# EAGLE design RFM96W-BB (EAGLE 7.3.0)
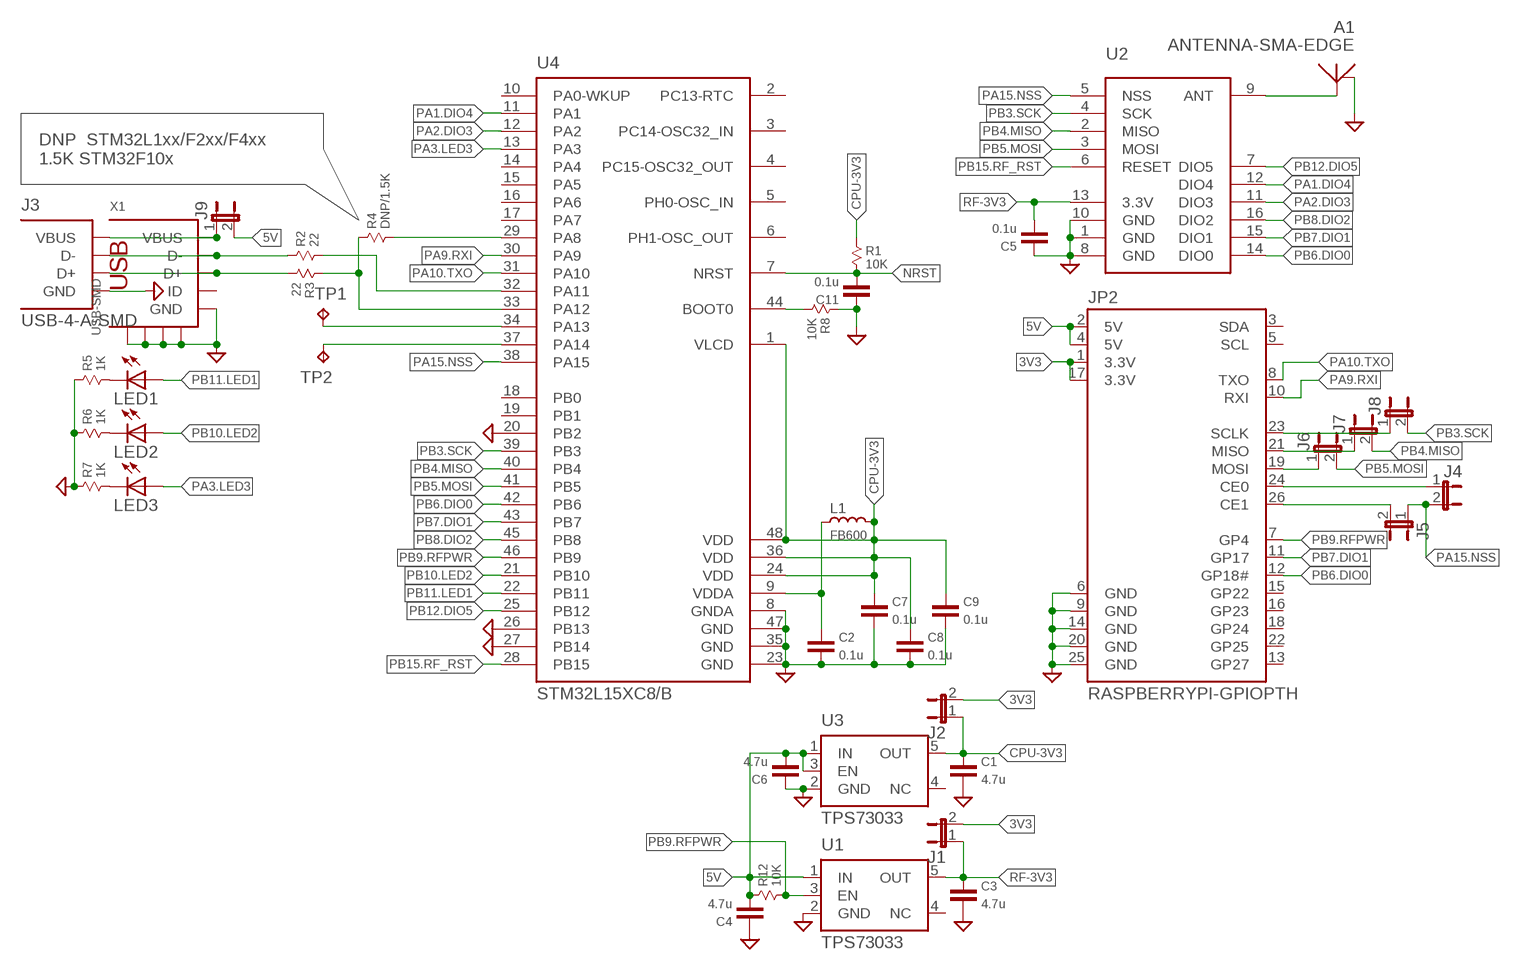
[diagram p0: schematic, sheet 1]

## Parts
A1  ANTENNA-SMA-EDGE  [SMA-EDGE]
C1  4.7u  CAP-0603  [0603]
C2  0.1u  CAP-0603  [0603]
C3  4.7u  CAP-0603  [0603]
C4  4.7u  CAP-0603  [0603]
C5  0.1u  CAP-0603  [0603]
C6  4.7u  CAP-0603  [0603]
C7  0.1u  CAP-0603  [0603]
C8  0.1u  CAP-0603  [0603]
C9  0.1u  CAP-0603  [0603]
C11  0.1u  CAP-0603  [0603]
J1  JUMPER-2SMD-NO  [SJ_2S-NO]
J2  JUMPER-2SMD-NO  [SJ_2S-NO]
J3  USB-4-A-SMD  [USB-A-SMD]
J4  JUMPER-2SMD-NO  [SJ_2S-NO]
J5  JUMPER-2SMD-NO  [SJ_2S-NO]
J6  JUMPER-2SMD-NO  [SJ_2S-NO]
J7  JUMPER-2SMD-NO  [SJ_2S-NO]
J8  JUMPER-2SMD-NO  [SJ_2S-NO]
J9  JUMPER-2SMD-NO  [SJ_2S-NO]
JP2  RASPBERRYPI-GPIOPTH  [2X13-SHROUDED]
L1  FB600  INDUCTOR-0603  [0603]
LED1  LEDCHIPLED_0603  [CHIPLED_0603]
LED2  LEDCHIPLED_0603  [CHIPLED_0603]
LED3  LEDCHIPLED_0603  [CHIPLED_0603]
R1  10K  RESISTOR-0603  [0603]
R2  22  RESISTOR-0603  [0603]
R3  22  RESISTOR-0603  [0603]
R4  DNP/1.5K  RESISTOR-0603  [0603]
R5  1K  RESISTOR-0603  [0603]
R6  1K  RESISTOR-0603  [0603]
R7  1K  RESISTOR-0603  [0603]
R8  10K  RESISTOR-0603  [0603]
R12  10K  RESISTOR-0603  [0603]
TP1  TPTP14R  [TP14R]
TP2  TPTP14R  [TP14R]
U1  TPS73033  [SOT23-5]
U2  RFM9XW  [RFM9XW]
U3  TPS73033  [SOT23-5]
U4  STM32L15XC8/B  [LQFP48]
X1  USB-SMD  [USB-MINIB]

## Nets
3V3: J1.2 J2.2 JP2.1(3.3V) JP2.17(3.3V)
5V: C4.1 C6.1 J9.2 JP2.2(5V) JP2.4(5V) R12.1 U1.1(IN) U3.1(IN) U3.3(EN)
CPU-3V3: C1.2 C7.2 C8.2 C9.2 J2.1 L1.2 R1.1 U3.5(OUT) U4.1(VLCD) U4.24(VDD) U4.36(VDD) U4.48(VDD)
GND: A1.GND@1(GND) C1.1 C2.1 C3.1 C4.2 C5.2 C6.2 C7.1 C8.1 C9.1 C11.2 J3.GND JP2.6(GND) JP2.9(GND) JP2.14(GND) JP2.20(GND) JP2.25(GND) R5.1 R6.1 R7.1 R8.1 U1.2(GND) U2.1(GND) U2.8(GND) U2.10(GND) U3.2(GND) U4.8(GNDA) U4.20(PB2) U4.23(GND) U4.26(PB13) U4.27(PB14) U4.35(GND) U4.47(GND) X1.GND X1.GND@1(GND) X1.GND@2(GND) X1.GND@3(GND) X1.GND@4(GND)
N$1: C2.2 L1.1 U4.9(VDDA)
N$3: A1.ANT U2.9(ANT)
N$4: J3.VUSB(VBUS) J9.1 X1.VBUS
N$7: J3.D- R2.1 X1.D-
N$8: J3.D+ R3.2 X1.D+
N$11: J8.1 JP2.23(SCLK)
N$12: J7.1 JP2.21(MISO)
N$14: J4.1 JP2.24(CE0)
N$15: J5.2 JP2.26(CE1)
N$16: R8.2 U4.44(BOOT0)
N$18: LED1.C R5.2
N$19: LED2.C R6.2
N$20: LED3.C R7.2
NRST: C11.1 R1.2 U4.7(NRST)
PA1.DIO4: U2.12(DIO4) U4.11(PA1)
PA2.DIO3: U2.11(DIO3) U4.12(PA2)
PA3.LED3: LED3.A U4.13(PA3)
PA8.D+H: R4.2 U4.29(PA8)
PA9.RXI: JP2.10(RXI) U4.30(PA9)
PA10.TXO: JP2.8(TXO) U4.31(PA10)
PA11.D-: R2.2 U4.32(PA11)
PA12.D+: R3.1 R4.1 U4.33(PA12)
PA13: TP1.TP U4.34(PA13)
PA14: TP2.TP U4.37(PA14)
PA15.NSS: J4.2 J5.1 U2.5(NSS) U4.38(PA15)
PB3.SCK: J8.2 U2.4(SCK) U4.39(PB3)
PB4.MISO: J7.2 U2.2(MISO) U4.40(PB4)
PB5.MOSI: J6.2 U2.3(MOSI) U4.41(PB5)
PB6.DIO0: JP2.12(GP18#) U2.14(DIO0) U4.42(PB6)
PB7.DIO1: JP2.11(GP17) U2.15(DIO1) U4.43(PB7)
PB8.DIO2: U2.16(DIO2) U4.45(PB8)
PB9.RFPWR: JP2.7(GP4) R12.2 U1.3(EN) U4.46(PB9)
PB10.LED2: LED2.A U4.21(PB10)
PB11.LED1: LED1.A U4.22(PB11)
PB12.DIO5: U2.7(DIO5) U4.25(PB12)
PB15.RF_RST: U2.6(RESET) U4.28(PB15)
R-MOSI: J6.1 JP2.19(MOSI)
RF-3V3: C3.2 C5.1 J1.1 U1.5(OUT) U2.13(3.3V)
Unconnected: JP2.3(SDA) JP2.5(SCL) JP2.13(GP27) JP2.15(GP22) JP2.16(GP23) JP2.18(GP24) JP2.22(GP25) U1.4(NC) U3.4(NC) U4.2(PC13-RTC) U4.3(PC14-OSC32_IN) U4.4(PC15-OSC32_OUT) U4.5(PH0-OSC_IN) U4.6(PH1-OSC_OUT) U4.10(PA0-WKUP) U4.14(PA4) U4.15(PA5) U4.16(PA6) U4.17(PA7) U4.18(PB0) U4.19(PB1) X1.ID

## Notes on the sheet
- DNP  STM32L1xx/F2xx/F4xx
  1.5K STM32F10x

## Library data of the parts
A1 = X893:ANTENNA: Antennes
C1-C9 C11 = X893:CAP: Capacitor
J1 J2 J4-J9 = X893:JUMPER-2: Jumper Basic 0.1" spaced jumper. Use with breakaway headers.
J3 = X893:USB-4: http://www.hirose.co.jp/cataloge_hp/e24200011.pdf
JP2 = SparkFun-Boards:RASPBERRYPI-GPIO: RASPBERRY PI I/O HEADER As defined for the Revistion 2 Pi.; DIST: sparkfun; DIST_ID: PRT-11490
L1 = X893:INDUCTOR: http://www.murata.com/products/catalog/pdf/o05e.pdf
LED1-LED3 = led:LED: LED OSRAM: - CHIPLED LG R971, LG N971, LY N971, LG Q971, LY Q971, LO R971, LY R971 LH N974, LH R974 LS Q976, LO Q976, LY Q976 LO Q996 - Hyper CHIPLED LW Q18S LB Q993, LB Q99A, LB R99A - SideLED LS A670, LO A670, LY A670, LG A670, LP A670 LB A673, LV A673, LT A673, LW A673 LH A674 LY A675 LS A676, LA A676, LO A676, LY A676, LW A676 LS A679, LY A679, LG A679 - Hyper Micro SIDELED® LS Y876, LA Y876, LO Y876, LY Y876 LT Y87S - SmartLED LW L88C, LW L88S LB L89C, LB L89S, LG L890 LS L89K, LO L89K, LY L89K LS L896, LA L896, LO L896, LY L896 - TOPLED LS T670, LO T670, LY T670, LG T670, LP T670 LSG T670, LSP T670, LSY T670, LOP T670, LYG T670 LG T671, LOG T671, LSG T671 LB T673, LV T673, LT T673, LW T673 LH T674 LS T676, LA T676, LO T676, LY T676, LB T676, LH T676, LSB T676, LW T676 LB T67C, LV T67C, LT T67C, LS T67K, LO T67K, LY T67K, LW E67C LS E67B, LA E67B, LO E67B, LY E67B, LB E67C, LV E67C, LT E67C LW T67C LS T679, LY T679, LG T679 LS T770, LO T770, LY T770, LG T770, LP T770 LB T773, LV T773, LT T773, LW T773 LH T774 LS E675, LA E675, LY E675, LS T675 LS T776, LA T776, LO T776, LY T776, LB T776 LHGB T686 LT T68C, LB T68C - Hyper Mini TOPLED® LB M676 - Mini TOPLED Santana® LG M470 LS M47K, LO M47K, LY M47K Source: http://www.osram.convergy.de LUXEON: - LUMILED® LXK2-PW12-R00, LXK2-PW12-S00, LXK2-PW14-U00, LXK2-PW14-V00 LXK2-PM12-R00, LXK2-PM12-S00, LXK2-PM14-U00 LXK2-PE12-Q00, LXK2-PE12-R00, LXK2-PE12-S00, LXK2-PE14-T00, LXK2-PE14-U00 LXK2-PB12-K00, LXK2-PB12-L00, LXK2-PB12-M00, LXK2-PB14-N00, LXK2-PB14-P00, LXK2-PB14-Q00 LXK2-PR12-L00, LXK2-PR12-M00, LXK2-PR14-Q00, LXK2-PR14-R00 LXK2-PD12-Q00, LXK2-PD12-R00, LXK2-PD12-S00 LXK2-PH12-R00, LXK2-PH12-S00 LXK2-PL12-P00, LXK2-PL12-Q00, LXK2-PL12-R00 Source: www.luxeon.com KINGBRIGHT: KA-3528ASYC Source: www.kingbright.com
R1-R8 R12 = X893:RESISTOR
TP1 TP2 = testpad:TP: Test pad
U1 U3 = X893:TPS73033: LOW-NOISE, HIGH PSRR, RF 200-mA LOW-DROPOUT LINEAR REGULATOR http://www.terraelectronica.ru/pdf/TI/TPS73033.pdf
U2 = X893:RFM9XW: RFM69HW ISM TRANSCEIVER MODULE http://www.hoperf.com/upload/rf/RFM69HW-V1.3.pdf
U4 = X893:STM32L15: http://www.st.com/internet/com/TECHNICAL_RESOURCES/TECHNICAL_LITERATURE/DATASHEET/CD00277537.pdf
X1 = X893:USB: USB Connectors USB-B-PTH is fully proven SKU : PRT-00139 USB-miniB is fully proven SKU : PRT-00587 USB-A-PCB is untested. USB-A-H is throughly reviewed, but untested. Spark Fun Electronics SKU : PRT-00437 USB-B-SMT is throughly reviewed, but untested. Needs silkscreen touching up. USB-A-S has not been used/tested USB-MB-H has not been used/tested

## Board
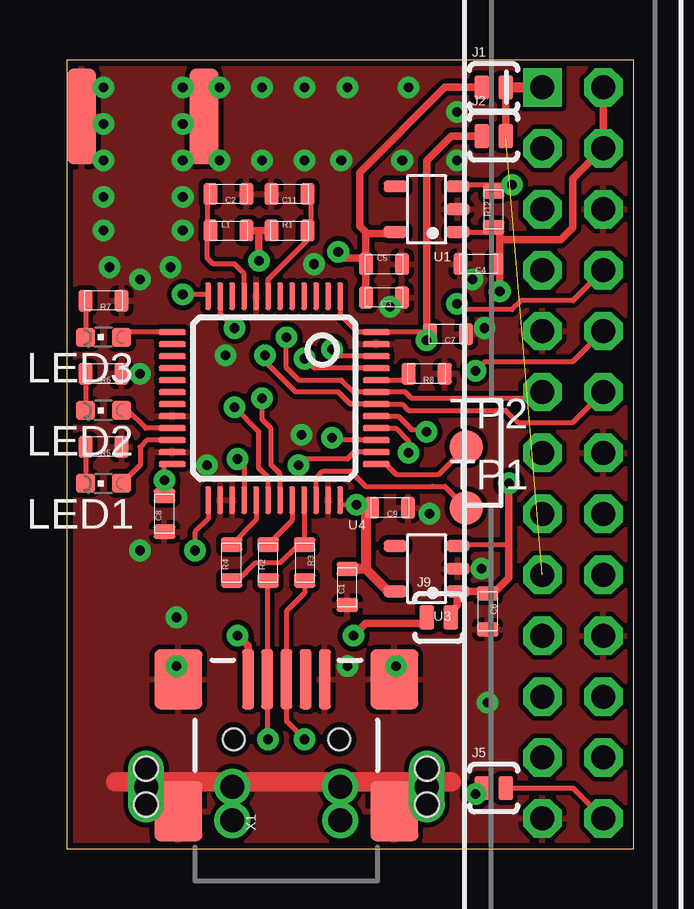
[diagram p1: board, top side]
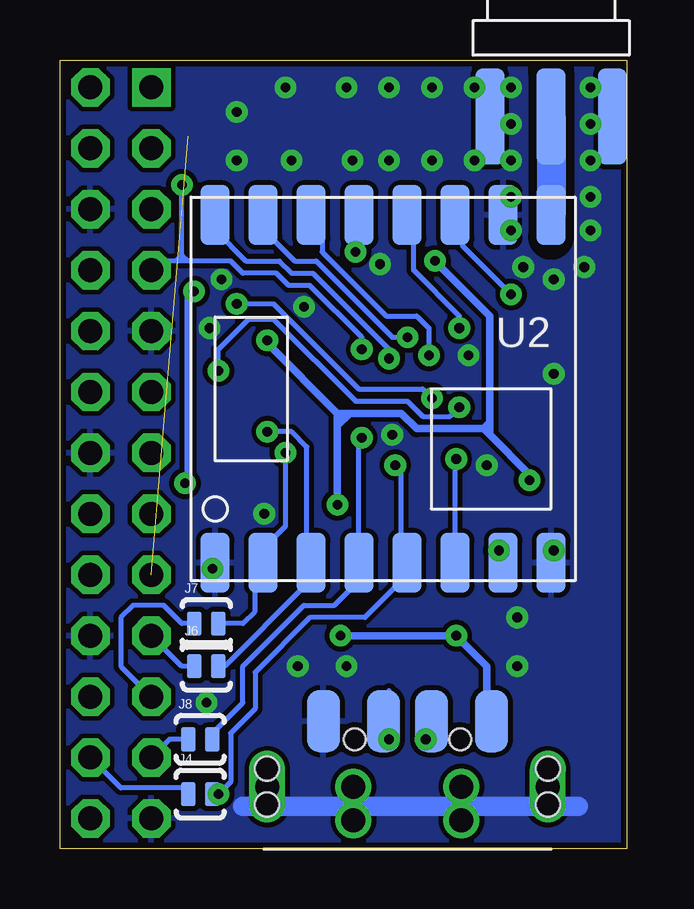
[diagram p2: board, bottom side, seen from below]

Size 23.62 x 32.89 mm. Coordinates in mm from the lower left corner, seen from the top.
Outline: 23.62,32.89 0,32.89 0,0 23.62,0 23.62,32.89
Copper layers (1+16): Top 0.035mm / dielectric 1.5mm / Bottom 0.035mm
Design rules "Rezonit": minimum track width 0.2mm, minimum drill 0.4mm, track to track 0.2mm, track to pad 0.2mm, pad to pad 0.2mm, via to via 0.2mm, smd to smd 0mil, copper to edge 0.25mm, drill to drill 0.4mm, minimum pad ring 0.25mm, minimum via ring 0.25mm, stop-mask expansion 4mil, vias tented up to drill 0.4mm, thermal gap 0.2mm
bRestrict: 1 lines

### Footprints (pad centres in the part's own frame; a part is rotated, then mirrored left to right if it is on the bottom)
SMA-EDGE = smd 4 x 1.2: ANT 2.5,0; GND@2 2.5,2.55; GND@4 2.5,-2.55 | smd 4 x 1.2 bottom: GND@1 2.5,2.55; GND@3 2.5,-2.55
0603 = smd 0.6 x 0.9: 1 -0.75,0; 2 0.75,0
SJ_2S-NO = smd 0.6 x 1: 1 -0.5,0; 2 0.5,0
USB-A-SMD = smd 2.6 x 1.4: D+ 5.325,1; D- 5.325,-1; GND 5.325,3.5; VUSB 5.325,-3.5 | drill 1 pad 1.4 long: GND@1 2.6,5.85; GND@2 2.6,-5.85 | drill 1: P$1 2.6,2.25; P$2 2.6,-2.25; P$3 1.2,2.25; P$4 1.2,-2.25 | hole 1: 3.35,-5.85; 1.85,-5.85; 3.35,5.85; 1.85,5.85
2X13-SHROUDED = drill 1 pad 1.6 square: 1 -1.27,15.24 | drill 1 pad 1.6 octagon: 2 1.27,15.24; 3 -1.27,12.7; 4 1.27,12.7; 5 -1.27,10.16; 6 1.27,10.16; 7 -1.27,7.62; 8 1.27,7.62; 9 -1.27,5.08; 10 1.27,5.08; 11 -1.27,2.54; 12 1.27,2.54; 13 -1.27,0; 14 1.27,0; 15 -1.27,-2.54; 16 1.27,-2.54; 17 -1.27,-5.08; 18 1.27,-5.08; 19 -1.27,-7.62; 20 1.27,-7.62; 21 -1.27,-10.16; 22 1.27,-10.16; 23 -1.27,-12.7; 24 1.27,-12.7; 25 -1.27,-15.24; 26 1.27,-15.24
CHIPLED_0603 = smd 0.8 x 0.8: A 0,-0.75; C 0,0.75
TP14R = smd 1.4 x 1.4: TP 0,0
SOT23-5 = smd 0.5 x 1: 1 -0.95,-1.3; 2 0,-1.3; 3 0.95,-1.3; 4 0.95,1.3; 5 -0.95,1.3
RFM9XW = smd 2.5 x 1.2: 1 -7.25,7; 2 -7.25,5; 3 -7.25,3; 4 -7.25,1; 5 -7.25,-1; 6 -7.25,-3; 7 -7.25,-5; 8 -7.25,-7; 9 7.25,-7; 10 7.25,-5; 11 7.25,-3; 12 7.25,-1; 13 7.25,1; 14 7.25,3; 15 7.25,5; 16 7.25,7
LQFP48 = smd 0.254 x 1.143: 1 -2.75,-4.25; 2 -2.25,-4.25; 3 -1.75,-4.25; 4 -1.25,-4.25; 5 -0.75,-4.25; 6 -0.25,-4.25; 7 0.25,-4.25; 8 0.75,-4.25; 9 1.25,-4.25; 10 1.75,-4.25; 11 2.25,-4.25; 12 2.75,-4.25; 25 2.75,4.25; 26 2.25,4.25; 27 1.75,4.25; 28 1.25,4.25; 29 0.75,4.25; 30 0.25,4.25; 31 -0.25,4.25; 32 -0.75,4.25; 33 -1.25,4.25; 34 -1.75,4.25; 35 -2.25,4.25; 36 -2.75,4.25 | smd 1.143 x 0.254: 13 4.25,-2.75; 14 4.25,-2.25; 15 4.25,-1.75; 16 4.25,-1.25; 17 4.25,-0.75; 18 4.25,-0.25; 19 4.25,0.25; 20 4.25,0.75; 21 4.25,1.25; 22 4.25,1.75; 23 4.25,2.25; 24 4.25,2.75; 37 -4.25,2.75; 38 -4.25,2.25; 39 -4.25,1.75; 40 -4.25,1.25; 41 -4.25,0.75; 42 -4.25,0.25; 43 -4.25,-0.25; 44 -4.25,-0.75; 45 -4.25,-1.25; 46 -4.25,-1.75; 47 -4.25,-2.25; 48 -4.25,-2.75
USB-MINIB = smd 2.5 x 0.5: D+ 2.5,0; D- 2.5,0.8; GND 2.5,-1.6; ID 2.5,-0.8; VBUS 2.5,1.6 | smd 2.5 x 2: GND@1 -3,-4.5; GND@2 -3,4.5; GND@3 2.5,4.5; GND@4 2.5,-4.5 | hole 0.9: 0,2.2; 0,-2.2

### Placement (x,y rotation side)
A1  3.16,33.04 270 bottom
C1  11.68,10.92 90 top
C2  6.73,27.3 180 top
C3  13.21,22.99 180 top
C4  17.14,24.38 180 top
C5  13.21,24.38 0 top
C6  17.53,9.91 270 top
C7  15.88,21.46 180 top
C8  4.06,13.97 90 top
C9  13.46,14.22 180 top
C11  9.27,27.3 180 top
J1  17.78,31.75 0 top
J2  17.78,29.72 0 top
J3  9.14,0 90 bottom
J4  17.78,2.29 0 bottom
J5  17.78,2.54 0 top
J6  17.53,7.62 0 bottom
J7  17.53,9.4 0 bottom
J8  17.78,4.57 0 bottom
J9  15.49,9.65 0 top
JP2  21.08,16.51 0 top
L1  6.73,25.78 0 top
LED1  1.52,15.24 90 top
LED2  1.52,18.29 90 top
LED3  1.52,21.34 90 top
R1  9.27,25.78 0 top
R2  8.38,11.94 90 top
R3  9.91,11.94 270 top
R4  6.86,11.94 90 top
R5  1.52,16.76 180 top
R6  1.52,19.81 180 top
R7  1.52,22.86 180 top
R8  14.99,19.81 180 top
R12  17.78,26.67 90 top
TP1  16.64,14.22 0 top
TP2  16.64,16.76 0 top
U1  14.99,26.67 90 top
U2  10.16,19.18 90 bottom
U3  14.99,11.68 90 top
U4  8.64,18.8 180 top
X1  9.14,4.57 90 top

### Tracks (layer width: path | path; a pad name or v marks a point on that pad's centre or on a via)
3V3  (1 unrouted)
  Top 0.305: J2.2 J1.2
  Top 0.406: J1.2 JP2.1
5V  (via drill 0.4)
  Top 0.2: U1.1 17.58,25.72 R12.1 | 18.03,24.14 C4.1 | U3.3 16.29,12.67 16.26,12.7
  Top 0.203: U3.3 16.44,12.63 16.51,12.7 18.41,12.7
  Top 0.305: R12.1 17.78,25.91 18.03,25.91 18.03,25.4 | 18.03,25.4 18.03,24.37 | 18.03,24.37 18.03,24.14 v18.03,23.24 | JP2.2 JP2.4 21.08,27.94 21.08,25.91 20.57,25.4 18.03,25.4 | 17.53,10.73 U3.1 16.26,10.7 16.26,10.16 15.99,9.9 J9.2 | 17.53,10.73 17.85,10.73 18.41,11.3 18.41,12.7 v18.41,15.24 | 18.03,24.37 C4.1 | C6.1 17.53,10.73
  Bottom 0.305: v18.41,15.24 18.29,15.37 18.29,22.99 v18.03,23.24
CPU-3V3  (via drill 0.4)
  Top 0.2: 11.7,11.68 C1.2 | U4.36 11.39,14.35 v12.06,14.35 12.7,14.35 C9.2 12.45,14.22 | C8.2 v4.06,15.37 4.06,16.05 U4.24 | C7.2 14.99,21.55 14.86,21.55 | v14.99,21.21 14.86,21.55 | 14.86,21.55 U4.48
  Top 0.203: U4.1 11.39,22.27 12.11,21.55 U4.48
  Top 0.305: L1.2 8,25.78 | 8,25.78 R1.1 | v8,24.51 8,25.78 | v14.99,21.21 14.99,21.55 14.99,28.7 16,29.72 J2.1
  Top 0.406: U3.5 13.4,10.73 12.45,11.68 | 12.45,11.68 11.7,11.68 | 12.45,14.22 12.45,11.68
  Bottom 0.305: v12.06,14.35 12.06,17.65 | 12.06,17.65 12.06,18.16 | 12.06,18.16 14.99,21.08 v14.99,21.21 | v4.06,15.37 4.06,15.62 5.71,17.27 | 5.71,17.27 5.97,17.53 | 5.97,17.53 8.76,17.53 9.4,18.16 11.56,18.16 | 11.56,18.16 12.06,18.16 | v8,24.51 5.71,22.23 5.71,17.78 | 5.71,17.78 5.97,17.53 | 5.71,17.78 5.71,17.27 | 12.06,17.65 11.56,18.16
GND  (via drill 0.4)
  Top 0.813: 2.03,2.79 16,2.79
  Bottom 0.2: U2.1 17.16,12.08 v17.27,11.68
  Bottom 0.813: 2.03,1.78 16,1.78
  other vias: 4.83,27.18 4.83,25.78 1.52,25.78 1.52,27.18 1.78,24.26 4.32,24.26 3.05,23.75 8.13,28.7 4.83,28.7 1.52,28.7 4.83,30.23 4.83,31.75 1.52,31.75 1.52,30.23 6.35,28.7 9.91,28.7 11.43,28.7 16.26,28.7 14.22,31.75 11.68,31.75 9.91,31.75 8.13,31.75 6.35,31.75 15.11,13.97 17.53,6.1 5.84,16 3.05,19.81 16.26,30.73 13.97,28.7 13.72,7.62 4.57,7.62 16.89,23.75 10.29,24.38 6.6,20.57 3.05,12.45 4.57,9.65 11.68,7.62 13.46,22.61 9.78,17.27 17.4,21.72
  pour Bottom: 23.62,0.02 0,0.02 0,32.84 23.62,32.84
  pour Top: 23.62,0.02 0,0.02 0,32.84 23.62,32.84
N$1
  Top 0.203: C2.2 5.85,27.18 5.84,27.18 5.84,25.92 L1.1 5.84,25.64 5.84,24.64 6.1,24.38 6.99,24.38 7.39,23.98 U4.9
N$3
  Bottom 1.2: A1.ANT U2.9
N$4  (via drill 0.4)
  Top 0.305: J9.1 14.99,9.41 14.99,9.4 12.45,9.4 v11.94,8.89 | X1.VBUS 7.54,8.46 v7.11,8.89
  Bottom 0.305: v11.94,8.89 v7.11,8.89 5.84,7.62 5.84,5.78
  Bottom 0.406: 5.84,5.78 J3.VUSB
N$7  (via drill 0.4)
  Top 0.2: v8.38,4.57 8.34,4.61 X1.D- 8.34,11.23 R2.1
  Bottom 0.2: J3.D- 8.4,5.06 v8.38,4.57
N$8  (via drill 0.4)
  Top 0.2: v9.91,4.57 9.14,5.33 X1.D+ 9.14,9.91 9.91,10.67 R3.2
  Bottom 0.2: 9.91,6.6 v9.91,4.57
  Bottom 0.203: J3.D+ 10.14,5.06 v9.91,4.57
N$11
  Bottom 0.2: J8.1 19.05,4.57 JP2.23
N$12
  Bottom 0.203: J7.1 18.54,9.4 19.3,10.16 20.57,10.16 21.08,9.65 21.08,7.62 JP2.21
N$14
  Bottom 0.203: J4.1 18.28,2.28 18.54,2.54 21.08,2.54 JP2.24
N$15
  Top 0.2: J5.2 21.08,2.54 JP2.26
N$16
  Top 0.203: U4.44 13.97,19.55 R8.2
N$18
  Top 0.203: R5.2 LED1.C
N$19
  Top 0.203: R6.2 LED2.C
N$20
  Top 0.203: R7.2 LED3.C
NRST
  Top 0.203: C11.1 10.03,27.3 10.16,27.18 10.16,25.92 R1.2 10.16,25.64 10.16,25.53 8.39,23.75 U4.7
PA1.DIO4  (via drill 0.4)
  Top 0.203: U4.11 6.39,22.32 v6.99,21.72
  Bottom 0.203: v6.99,21.72 6.99,22.23 8.89,24.13 8.89,26.16 U2.12
PA2.DIO3  (via drill 0.4)
  Top 0.203: v4.83,23.11 5.84,23.11 5.89,23.16 U4.12
  Bottom 0.203: U2.11 7.16,25.96 6.86,25.65 6.86,25.15 v4.83,23.11
PA3.LED3
  Top 0.203: U4.13 2.23,21.55 LED3.A
PA8.D+H
  Top 0.203: U4.29 7.89,13.73 R4.2
PA9.RXI  (via drill 0.4)
  Top 0.2: 8.39,14.98 8.38,14.99 | 8,17.4 v6.99,18.41 | v17.02,19.94 17.4,20.32 21.08,20.32 JP2.10
  Top 0.203: 8,17.4 8,15.88 8.39,15.49 8.39,14.98 U4.30
  Bottom 0.2: v17.02,19.94 17.02,20.83 15.75,22.1 14.73,22.1 11.3,18.67 9.14,18.67 8.51,18.03 7.37,18.03 v6.99,18.41
PA10.TXO  (via drill 0.4)
  Top 0.2: JP2.8 21.08,22.86 18.92,22.86 18.54,22.48 16.51,22.48 v16.26,22.73 | 8.89,14.73
  Top 0.203: v8.13,18.8 8.13,17.91 8.51,17.53 8.51,16 8.89,15.62 8.89,14.73 U4.31
  Bottom 0.2: v16.26,22.73 14.73,22.73 11.18,19.18 8.51,19.18 v8.13,18.8
PA11.D-
  Top 0.2: U4.32 9.39,13.7 R2.2
PA12.D+
  Top 0.2: U4.33 9.89,12.71 R3.1
  Top 0.203: R4.1 6.86,11.18 7.11,11.18 7.87,11.94 8.89,11.94 9.65,12.7 R3.1
PA13
  Top 0.2: U4.34 10.39,15.47 10.67,15.75 11.81,15.75 12.45,15.11 15.24,15.11
  Top 0.203: 15.24,15.11 15.75,15.11 TP1.TP
PA14
  Top 0.203: U4.37 13.29,16.05 13.72,15.62 15.49,15.62 TP2.TP
PA15.NSS  (via drill 0.4)
  Top 0.203: J5.1 v17.02,2.29 | U4.38 11.97,16.55 11.68,16.26 9.91,16.26 v9.65,16
  Bottom 0.2: v9.65,16 9.4,15.75 9.4,12.7 9.16,12.46 U2.5 9.4,11.69
  Bottom 0.203: 9.4,11.69 9.4,11.18 10.92,9.65 13.21,9.65 15.49,7.37 15.49,5.84 16.51,4.83 16.51,2.79 v17.02,2.29 J4.2
PB3.SCK  (via drill 0.4)
  Top 0.2: U4.39 11.15,17.05 v11.05,17.14
  Bottom 0.2: U2.4 11.16,12.68 11.18,12.7 11.18,17.02 v11.05,17.14 | J8.2 17.27,4.83 16,6.1 16,7.62 13.46,10.16
  Bottom 0.203: 13.46,10.16 12.19,10.16 11.43,10.92 11.43,11.66 U2.4
PB4.MISO  (via drill 0.4)
  Top 0.2: U4.40 13.7,17.55 14.22,17.02 v14.22,16.51
  Bottom 0.2: v14.22,16.51 14.22,13.46 15.16,12.53 U2.2 15.24,11.85 15.24,11.68 15.49,11.43
  Bottom 0.203: 15.49,11.43 15.49,9.91 16,9.4 J7.2
PB5.MOSI  (via drill 0.4)
  Top 0.2: U4.41 13.2,18.05
  Top 0.203: 13.2,18.05 13.8,18.05 14.37,17.48 14.9,17.48 v14.99,17.4
  Bottom 0.2: J6.2 16.76,7.62 13.46,10.92 13.46,11.18 13.16,11.48 U2.3 13.16,11.99 13.34,12.19 13.34,16.76 13.97,17.4 v14.99,17.4
PB6.DIO0  (via drill 0.4)
  Top 0.203: JP2.12 21.08,17.78 18.8,17.78 18.29,18.29 14.22,18.29 13.97,18.55 U4.42 11.81,18.55 11.3,19.05 9.53,19.05 8.26,20.32 v8.26,20.57
  Bottom 0.203: U2.14 13.16,25.86 12.7,25.4 12.7,24.89 10.03,22.23 8.76,22.23 8.26,21.72 v8.26,20.57
PB7.DIO1  (via drill 0.4)
  Top 0.203: v9.14,21.34 9.14,20.07 9.65,19.56 11.43,19.56 11.94,19.05 U4.43 14.1,19.05 14.35,18.8 19.56,18.8 JP2.11
  Bottom 0.203: U2.15 15.16,25.83 13.84,24.51 12.95,24.51 9.78,21.34 v9.14,21.34
PB8.DIO2  (via drill 0.4)
  Top 0.203: U4.45 10.31,20.05 v9.91,20.45
  Bottom 0.203: U2.16 17.16,25.8 15.88,24.51 14.48,24.51 13.97,24 13.08,24 9.91,20.83 v9.91,20.45
PB9.RFPWR  (via drill 0.4)
  Top 0.203: U4.46 11.33,20.55 v11.05,20.83 | U1.3 16.06,27.62 16.13,27.69 17.78,27.69 | 17.78,27.69 v18.54,27.69 | R12.2 17.78,27.69
  Bottom 0.203: v11.05,20.83 11.05,21.34 13.21,23.5 14.1,23.5 14.61,24 16,24 16.51,24.51 18.29,24.51 | 18.29,24.51 18.54,24.51 | 18.54,24.51 18.54,24.77 | 18.54,24.77 v18.54,27.69 | 18.54,24.51 18.8,24.51 | 18.8,24.51 19.3,24.51 JP2.7 | 18.54,24.77 18.29,24.51 | 18.54,24.77 18.8,24.51
PB10.LED2
  Top 0.203: U4.21 3.28,17.55 2.54,18.29 LED2.A
PB11.LED1
  Top 0.203: U4.22 3.33,17.05 3.05,16.76 3.05,16 2.54,15.49 2.27,15.49 LED1.A
PB12.DIO5  (via drill 0.4)
  Top 0.203: U4.25 5.89,13.76 5.33,13.21 v5.33,12.45
  Bottom 0.203: v5.33,12.45 5.08,12.1 U2.7
PB15.RF_RST  (via drill 0.4)
  Top 0.203: v7.11,16.26 7.39,15.98 U4.28
  Bottom 0.203: U2.6 7.16,16.05 v7.11,16.26
R-MOSI
  Bottom 0.2: J6.1 18.54,7.62 JP2.19
RF-3V3  (via drill 0.4)
  Top 0.305: 12.45,24.64 12.45,24.4 | 12.45,22.86 12.45,24.37 | J1.1 15.75,31.75 12.19,28.19 12.19,25.97 12.45,25.72 12.45,25.65 | 12.45,24.64 11.56,24.64 v11.3,24.89 | 12.45,25.65 12.45,24.64 | U1.5 13.53,25.72 13.46,25.65 12.45,25.65
  Top 0.406: 12.45,24.4 C5.1 12.45,24.37 | C3.2 12.45,22.86
  Bottom 0.305: U2.13 11.3,26.28 v11.3,24.89

### Text on the board
Reference: RF | 3V3 | 5V | 5V | GND | PWREN | TXD | LED3 | GND | RXD | LED2 | DIO1 | DIO0 | LED1 | GND | MOSI | GND | MISO | CLK | CE0 | GND | CE1 | USB-A / mini USB